# Altium schematic sheet Load-Network.SchDoc
size A; SheetNumber: 1; SheetTotal: 1
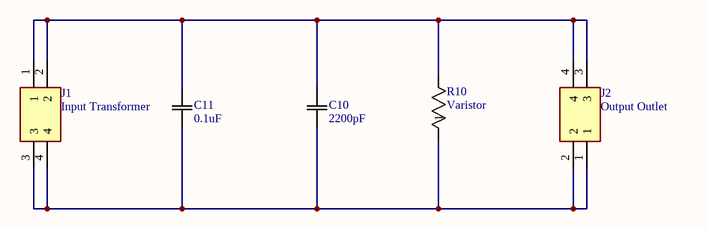
[diagram p0: Load-Network.SchDoc]

## Parts
C10  2200pF  [CAP_B81123C1222M289_TDK]
C11  0.1uF  [CAPM24X11.3_20.3_1_VIS]
J1  Input Transformer  [1709681]
J2  Output Outlet  [1709681]
R10  Varistor  [RES_VE24_AVX]

## Nets
NetC10_1: C10.1 C11.1 J1.3 J1.4 J2.1 J2.2 R10.1
NetC10_2: C10.2 C11.2 J1.1 J1.2 J2.3 J2.4 R10.2

## Library data of the parts
C10 = B81123C1222M289: No Description Available; Mfr_Name: TDK; Type: DEV; Copyright: Copyright (C) 2022 Ultra Librarian. All rights reserved.; Manufacturer_Part_Number: B81123C1222M289; Digi-Key_Part_Number_1: 495-76974-1-ND; Digi-Key_Part_Number_2: 495-76974-3-ND; RefDes: RefDes
C11 = PME261JC6100KR19T0: No Description Available; Mfr_Name: Vishay; Type: DEV; Copyright: Copyright (C) 2022 Ultra Librarian. All rights reserved.; Manufacturer_Part_Number: PME261JC6100KR19T0; Digi-Key_Part_Number_1: 399-11794-1-ND; Digi-Key_Part_Number_2: 399-11794-2-ND; RefDes: RefDes
J1 J2 = 1709681: Connector; Manufacturer_Name: Phoenix Contact; Datasheet Link: https://componentsearchengine.com//1709681.pdf; Height: 31mm; Mouser2 Part Number: 651-1709681; Mouser2 Price/Stock: https://www.mouser.com/Search/Refine.aspx?Keyword=651-1709681; Manufacturer_Part_Number: 1709681
R10 = VE24P00511K--: No Description Available; Mfr_Name: KYOCERA AVX; Copyright: Copyright (C) 2022 Ultra Librarian. All rights reserved.; Manufacturer_Part_Number: VE24P00511K--; Digi-Key_Part_Number_1: VE24P00511K--ND; RefDes: RefDes; Type: DEV